# Altium schematic sheet Temporizador_V7_top.SchDoc
size A4; SheetNumber: 1; SheetTotal: 9
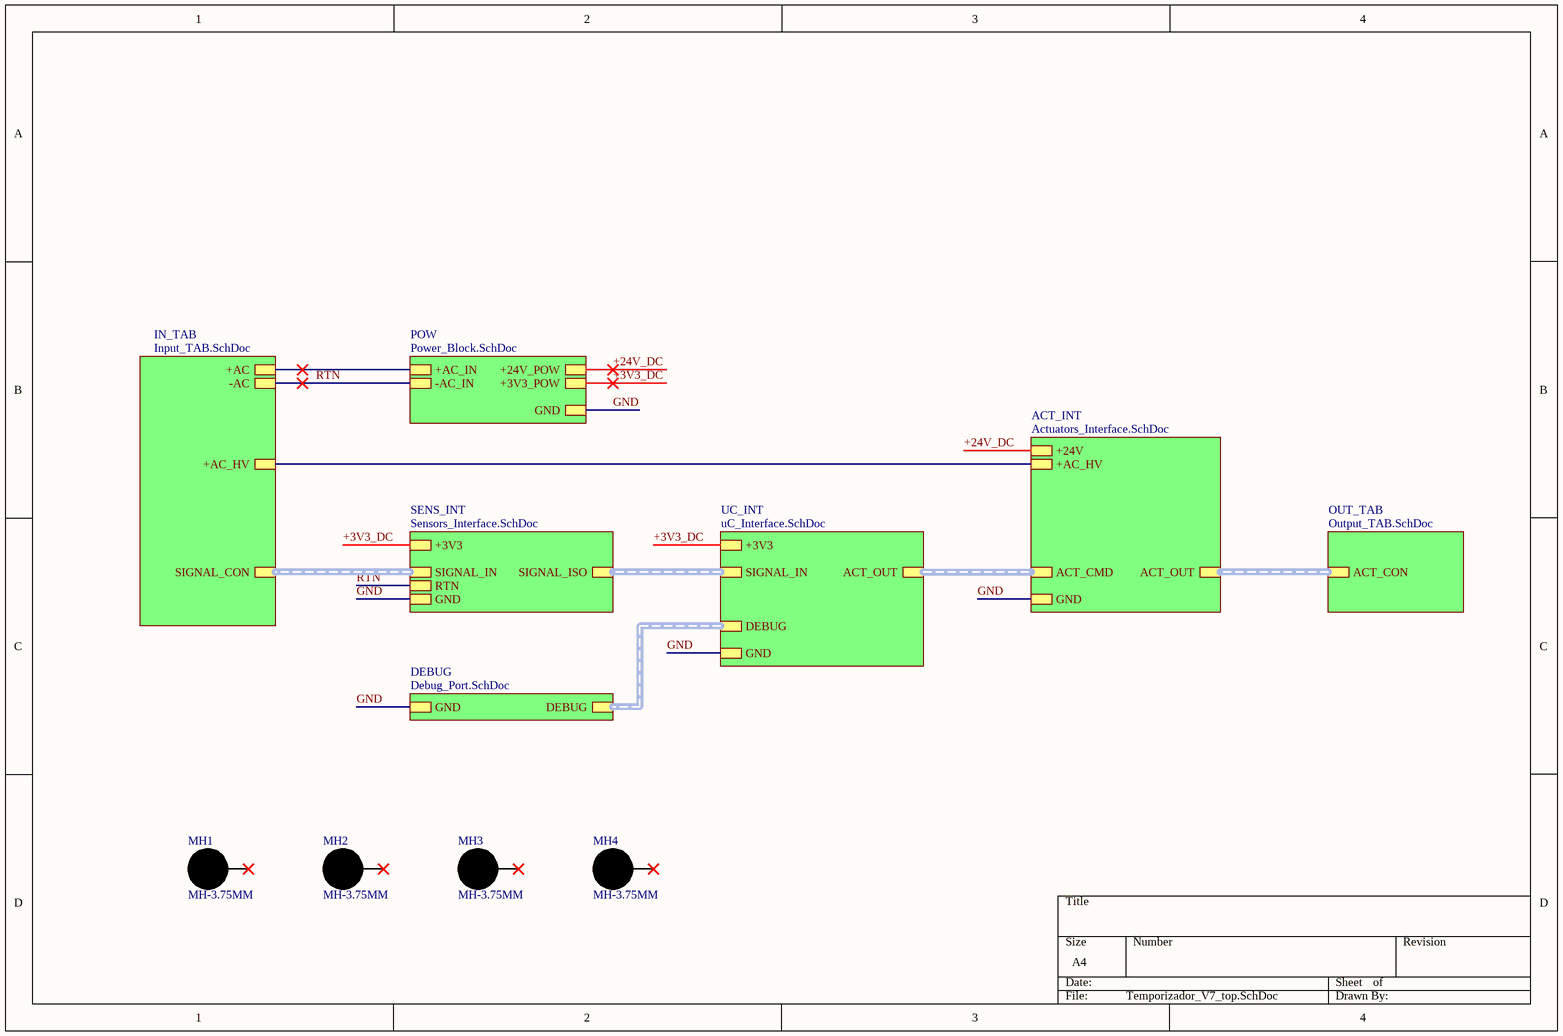
[diagram p0: Temporizador_V7_top.SchDoc]

## Parts
MH1  MH-3.75MM  [MH-3.75mm-NP]
MH2  MH-3.75MM  [MH-3.75mm-NP]
MH3  MH-3.75MM  [MH-3.75mm-NP]
MH4  MH-3.75MM  [MH-3.75mm-NP]

## Sub-sheets
ACT_INT = Actuators_Interface.SchDoc: ACT_CMD (harness ACT_OUT), +24V, GND, +AC_HV, ACT_OUT (harness ACT_OUT)
DEBUG = Debug_Port.SchDoc: DEBUG (harness DEBUG), GND
IN_TAB = Input_TAB.SchDoc: +AC_HV, +AC, SIGNAL_CON (harness SIGNAL_BUS), -AC
OUT_TAB = Output_TAB.SchDoc: ACT_CON (harness ACT_OUT)
POW = Power_Block.SchDoc: +AC_IN, -AC_IN, +3V3_POW, +24V_POW, GND
SENS_INT = Sensors_Interface.SchDoc: SIGNAL_ISO (harness SIGNAL_BUS), SIGNAL_IN (harness SIGNAL_BUS), +3V3, GND, RTN
UC_INT = uC_Interface.SchDoc: SIGNAL_IN (harness SIGNAL_BUS), ACT_OUT (harness ACT_OUT), GND, +3V3, DEBUG (harness DEBUG)

## Nets
+3V3_DC: sheet POW/+3V3_POW, sheet SENS_INT/+3V3, sheet UC_INT/+3V3
+24V_DC: sheet POW/+24V_POW, sheet ACT_INT/+24V
GND: sheet POW/GND, sheet ACT_INT/GND, sheet SENS_INT/GND, sheet UC_INT/GND, sheet DEBUG/GND
RTN: sheet POW/-AC_IN, sheet IN_TAB/-AC, sheet SENS_INT/RTN
(unnamed): sheet POW/+AC_IN, sheet IN_TAB/+AC
(unnamed): sheet ACT_INT/+AC_HV, sheet IN_TAB/+AC_HV

Not connected (* = marked no-connect by the designer): MH1 1*; MH2 1*; MH3 1*; MH4 1*

## Buses and harness runs
harness sheet ACT_INT/ACT_CMD = sheet UC_INT/ACT_OUT
harness sheet ACT_INT/ACT_OUT = sheet OUT_TAB/ACT_CON
harness sheet DEBUG/DEBUG = sheet UC_INT/DEBUG
harness sheet IN_TAB/SIGNAL_CON = sheet SENS_INT/SIGNAL_IN
harness sheet SENS_INT/SIGNAL_ISO = sheet UC_INT/SIGNAL_IN